# EAGLE design modul_procesora (EAGLE 9.7.0)
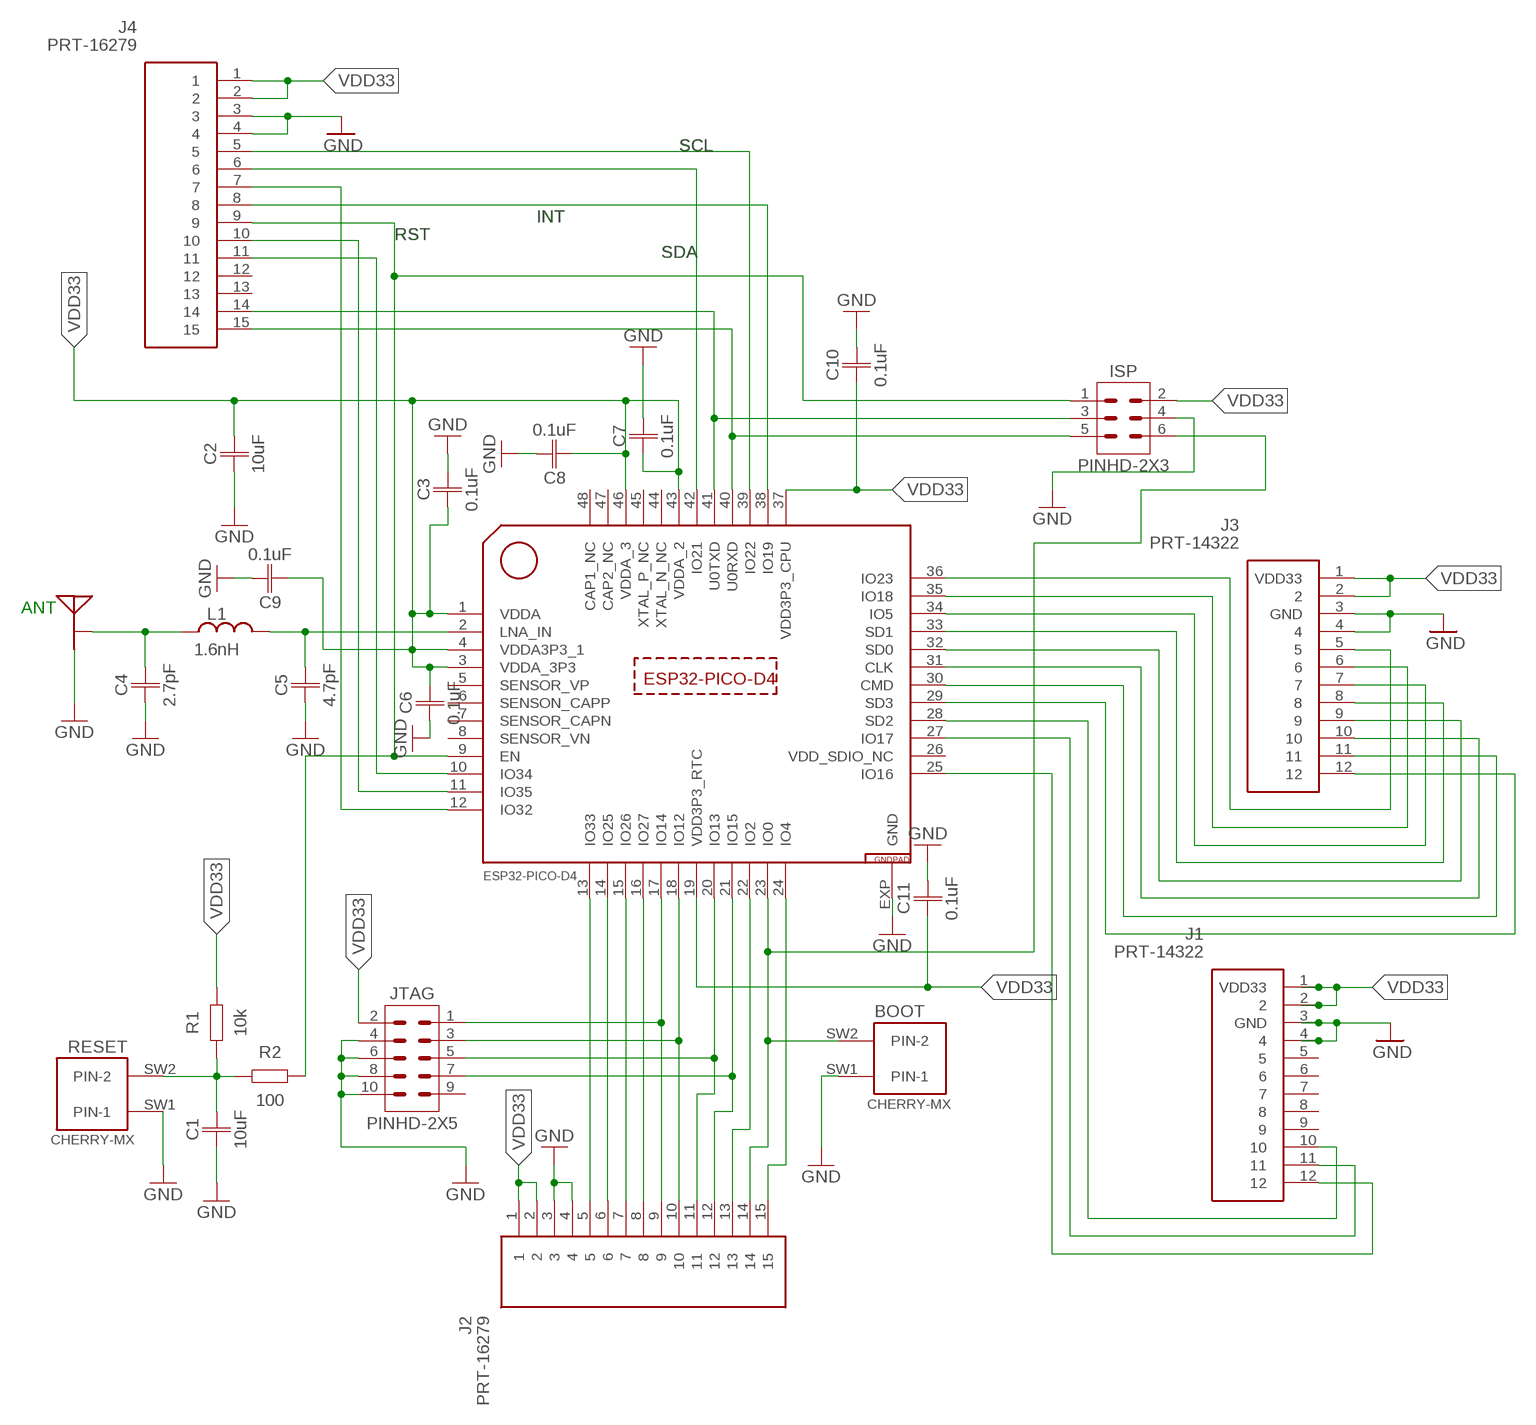
[diagram p0: schematic, sheet 1]

## Parts
ANT  ANT  MEANDER-ANT  [MEANDER-ANT]
BOOT  BOOT  CHERRY-MX  [CHERRY-MX]
C1  10uF  C_CHIP-0402(1005-METRIC)  [CAPC1005X60]
C2  10uF  C_CHIP-0402(1005-METRIC)  [CAPC1005X60]
C3  0.1uF  C_CHIP-0402(1005-METRIC)  [CAPC1005X60]
C4  2.7pF  C_CHIP-0402(1005-METRIC)  [CAPC1005X60]
C5  4.7pF  C_CHIP-0402(1005-METRIC)  [CAPC1005X60]
C6  0.1uF  C_CHIP-0402(1005-METRIC)  [CAPC1005X60]
C7  0.1uF  C_CHIP-0402(1005-METRIC)  [CAPC1005X60]
C8  0.1uF  C_CHIP-0402(1005-METRIC)  [CAPC1005X60]
C9  0.1uF  C_CHIP-0402(1005-METRIC)  [CAPC1005X60]
C10  0.1uF  C_CHIP-0402(1005-METRIC)  [CAPC1005X60]
C11  0.1uF  C_CHIP-0402(1005-METRIC)  [CAPC1005X60]
ISP  PINHD-2X3  [2X03]
J1  PRT-14322  [RHDR12W87P0X254_1X12_3103X250X]
J2  PRT-16279  [PRT16279]
J3  PRT-14322  [RHDR12W87P0X254_1X12_3103X250X]
J4  PRT-16279  [PRT16279]
JTAG  PINHD-2X5  [2X05]
L1  1.6nH  INDUCTOR_CHIP-0402(1006-METRIC)  [INDC1006X60N]
R1  10k  R_CHIP-0402(1005-METRIC)  [RESC1005X40]
R2  100  R_CHIP-0402(1005-METRIC)  [RESC1005X40]
RESET  CHERRY-MX  [CHERRY-MX]
U$1  ESP32-PICO-D4  [QFN48]

## Nets
GND: ANT.FEED BOOT.SW1(PIN-1) C1.1 C2.1 C3.2 C4.1 C5.1 C6.1 C7.2 C8.2 C9.2 C10.2 C11.2 ISP.4 J1.3(GND) J1.4 J2.3 J2.4 J3.3(GND) J3.4 J4.3 J4.4 JTAG.4 JTAG.6 JTAG.8 JTAG.10 RESET.SW1(PIN-1) U$1.EXP(GND)
INT: J4.8 U$1.38(IO19)
N$1: BOOT.SW2(PIN-2) ISP.6 J2.14 U$1.23(IO0)
N$2: C1.2 R1.1 R2.1 RESET.SW2(PIN-2)
N$4: J2.9 JTAG.1 U$1.17(IO14)
N$5: J2.10 JTAG.3 U$1.18(IO12)
N$6: J2.11 JTAG.5 U$1.20(IO13)
N$7: J2.12 JTAG.7 U$1.21(IO15)
N$8: ISP.5 J4.15 U$1.40(U0RXD)
N$9: ISP.3 J4.14 U$1.41(U0TXD)
N$10: ANT.GND C4.2 L1.1
N$11: C5.2 L1.2 U$1.2(LNA_IN)
N$12: J3.5 U$1.36(IO23)
N$13: J3.6 U$1.35(IO18)
N$14: J3.7 U$1.34(IO5)
N$15: J3.8 U$1.33(SD1)
N$16: J3.9 U$1.32(SD0)
N$17: J3.10 U$1.31(CLK)
N$18: J3.11 U$1.30(CMD)
N$19: J3.12 U$1.29(SD3)
N$20: J1.10 U$1.28(SD2)
N$21: J1.11 U$1.27(IO17)
N$22: J1.12 U$1.25(IO16)
N$23: J2.15 U$1.24(IO4)
N$24: J2.13 U$1.22(IO2)
N$25: J2.8 U$1.16(IO27)
N$26: J2.7 U$1.15(IO26)
N$27: J2.6 U$1.14(IO25)
N$28: J2.5 U$1.13(IO33)
N$32: J4.7 U$1.12(IO32)
N$33: J4.10 U$1.11(IO35)
N$34: J4.11 U$1.10(IO34)
RST: ISP.1 J4.9 R2.2 U$1.9(EN)
SCL: J4.5 U$1.39(IO22)
SDA: J4.6 U$1.42(IO21)
VDD33: C2.2 C3.1 C6.2 C7.1 C8.1 C9.1 C10.1 C11.1 ISP.2 J1.1(VDD33) J1.2 J2.1 J2.2 J3.1(VDD33) J3.2 J4.1 J4.2 JTAG.2 R1.2 U$1.1(VDDA) U$1.3(VDDA_3P3) U$1.4(VDDA3P3_1) U$1.19(VDD3P3_RTC) U$1.37(VDD3P3_CPU) U$1.43(VDDA_2) U$1.46(VDDA_3)
Unconnected: J1.5 J1.6 J1.7 J1.8 J1.9 J4.12 J4.13 JTAG.9 U$1.5(SENSOR_VP) U$1.6(SENSON_CAPP) U$1.7(SENSOR_CAPN) U$1.8(SENSOR_VN) U$1.44(XTAL_N_NC) U$1.45(XTAL_P_NC) U$1.47(CAP2_NC) U$1.48(CAP1_NC)

## Notes on the sheet
- SCL
- INT
- RST
- SDA
- ANT

## Power pins joined to a net without a drawn wire
VDD_SDIO_NC: U$1.26(VDD_SDIO_NC)

## Library data of the parts
ANT = Antennas:MEANDER-ANT
BOOT RESET = cherrymx:CHERRY-MX: Cherry MX series keyswitch
C1-C11 = Capacitor:C: Capacitor - Generic; CATEGORY: Capacitor; PACKAGE_SIZE: 0402; PACKAGE_TYPE: Surface Mount; SUBCATEGORY: Ceramic Capacitors; TYPE: MLCC
ISP = Connector:PINHD-2X3: Pin Header; CATEGORY: Connectors; DESCRIPTION: Header-Straight-2x3 Position; PACKAGE_TYPE: Through Hole; PITCH: 0.100" (2.54mm); SUBCATEGORY: Headers; TYPE: Male Pins
J1 J3 = PRT-14322:PRT-14322: SparkFun Accessories Photon Stackable Header- 12 Pin Source: Datasheet <https://cdn.sparkfun.com/datasheets/Prototyping/SP-140520-XX-001.pdf>; DESCRIPTION: SparkFun Accessories Photon Stackable Header- 12 Pin; HEIGHT: 8.65mm; MANUFACTURER_NAME: SparkFun; MANUFACTURER_PART_NUMBER: PRT-14322; MOUSER_PART_NUMBER: 474-PRT-14322; MOUSER_PRICE-STOCK: https://www.mouser.co.uk/ProductDetail/SparkFun/PRT-14322?qs=YCa%2FAAYMW006l9RrtPHkxQ%3D%3D
J2 J4 = PRT-16279:PRT-16279: ARDUINO NANO STACKABLE HEADERS Source: Datasheet <https://cdn.sparkfun.com/assets/8/d/8/4/7/DS-16279-Arduino_Nano_Stackable_Header_Kit.pdf>; DESCRIPTION: ARDUINO NANO STACKABLE HEADERS; HEIGHT: 8.65mm; MANUFACTURER_NAME: SparkFun; MANUFACTURER_PART_NUMBER: PRT-16279; MOUSER_PART_NUMBER: 474-PRT-16279; MOUSER_PRICE-STOCK: https://www.mouser.co.uk/ProductDetail/SparkFun/PRT-16279?qs=vmHwEFxEFR8I6W1vfufYPg%3D%3D
JTAG = Connector:PINHD-2X5: Pin Header; CATEGORY: Connectors; DESCRIPTION: Header-Straight-2x5 Position; PACKAGE_TYPE: Through Hole; PITCH: 0.100" (2.54mm); SUBCATEGORY: Headers; TYPE: Male Pins
L1 = Tinkercad:INDUCTOR: Inductor Fixed - Generic; CATEGORY: Inductor; SUB-CATEGORY: Fixed
R1 R2 = Resistor:R: Resistor Fixed - Generic; CATEGORY: Resistors; DESCRIPTION: Chip Resistor 1.05 X 0.54 X 0.40 mm body 0402(1005-METRIC) Package; PACKAGE_SIZE: 0402; PACKAGE_TYPE: Surface Mount
U$1 = ESP32-PICO-D4:ESP32-PICO-D4

## Board
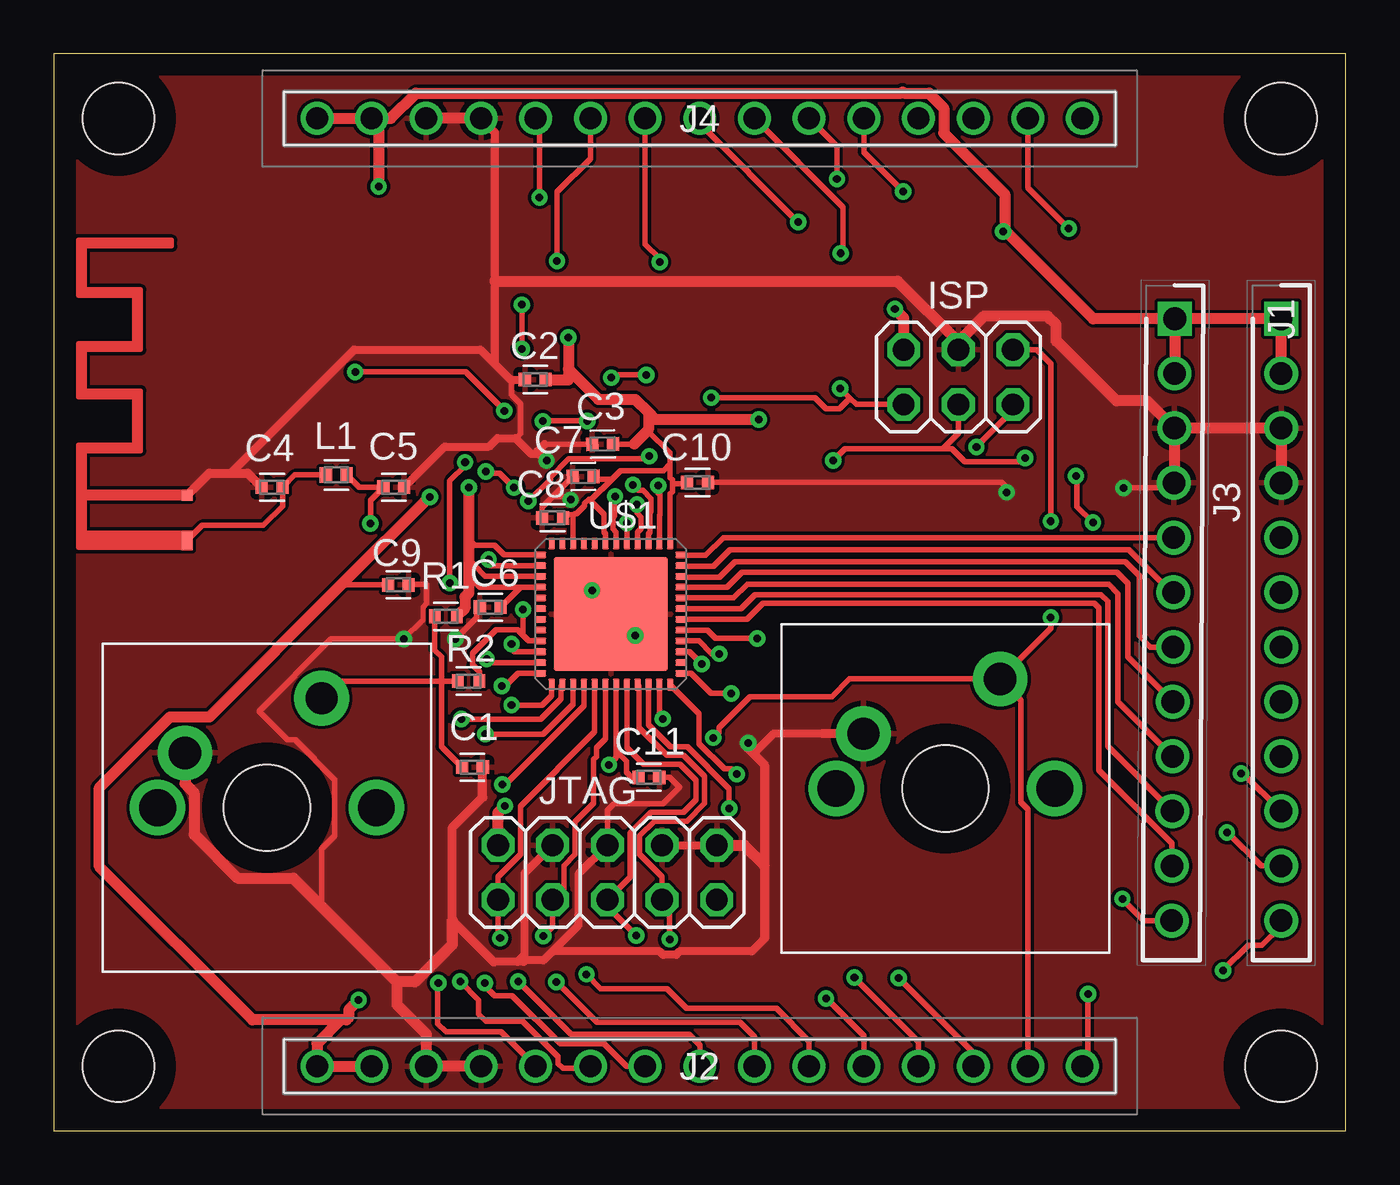
[diagram p1: board, top side]
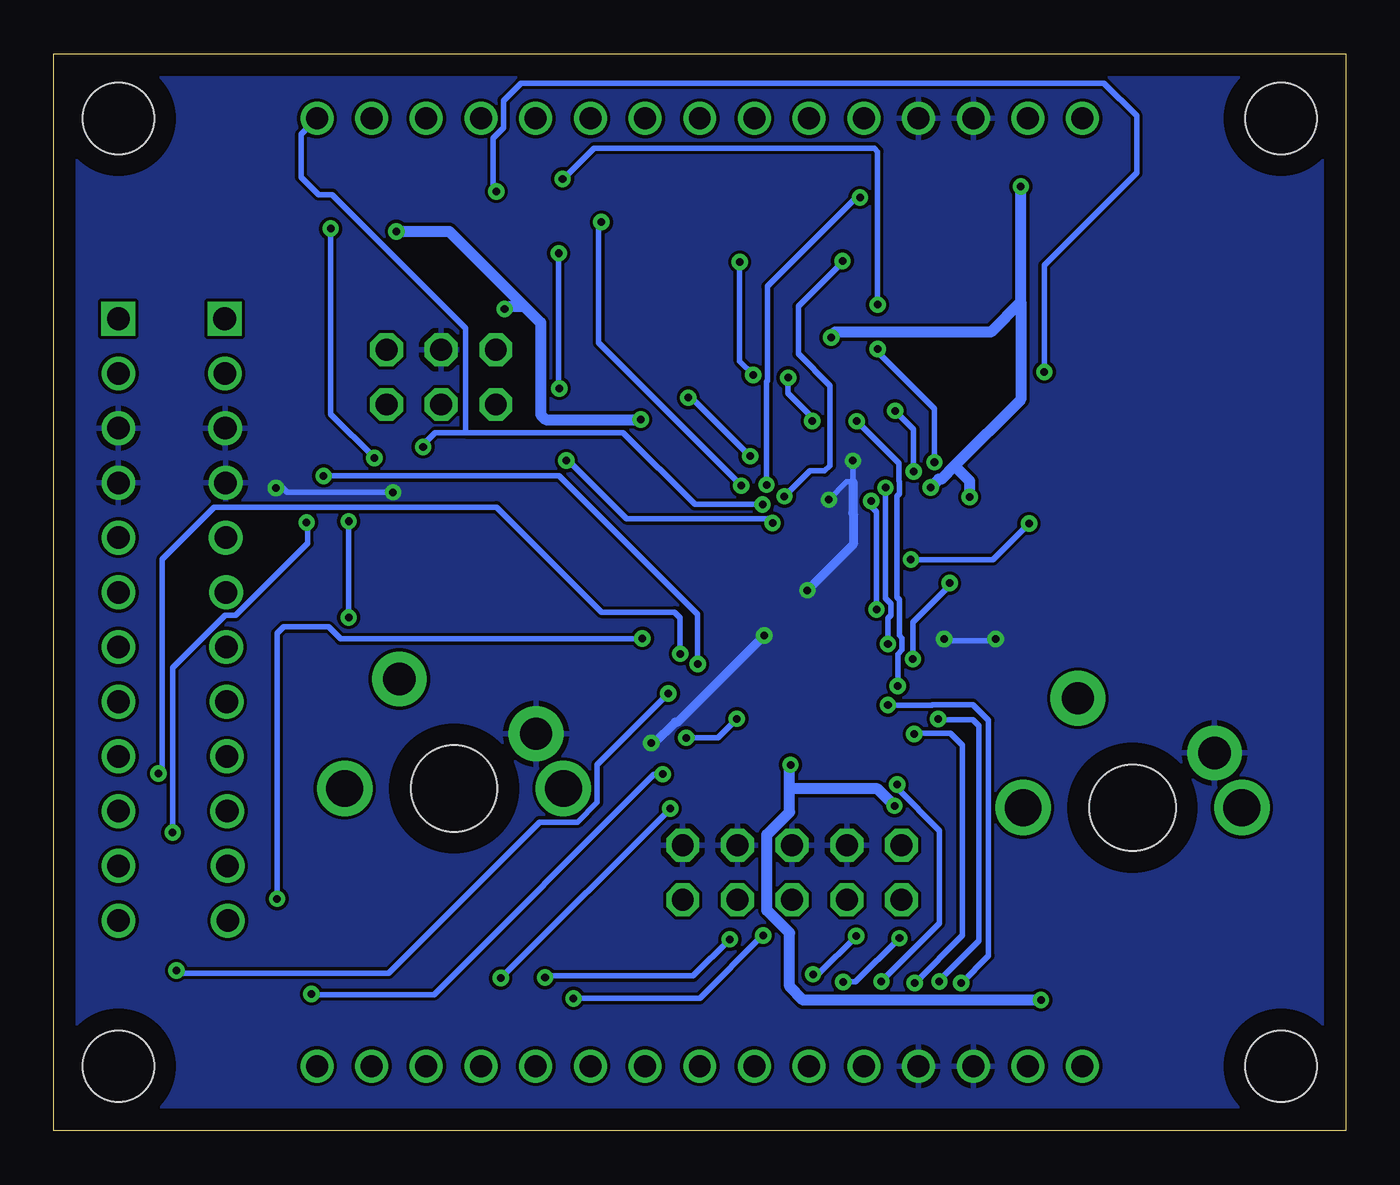
[diagram p2: board, bottom side, seen from below]

Size 60 x 50 mm. Coordinates in mm from the lower left corner, seen from the top.
Outline: 0,0 60,0 60,50 0,50 0,0
Copper layers (1*16): Top 0.035mm / dielectric 1.5mm / Bottom 0.035mm
Design rules "Fusion Electronics Design Rules": minimum track width 6mil, minimum drill 0.35mm, track to track 6mil, track to pad 6mil, pad to pad 6mil, via to via 6mil, smd to smd 6mil, copper to edge 40mil, drill to drill 6mil, minimum pad ring 10mil, minimum via ring 8mil, stop-mask expansion 4mil, vias tented up to drill 9999mil, thermal gap 10mil

### Footprints (pad centres in the part's own frame; a part is rotated, then mirrored left to right if it is on the bottom)
MEANDER-ANT = smd 0.5 x 0.5: FEED 2.55,-0.25 | smd 0.9 x 0.5: GND 0.45,-0.25
CHERRY-MX = drill 1.714 pad 1.93: P$3 -5.08,0; P$4 5.08,0 | drill 1.5 pad 2.54: SW1 -3.81,2.54; SW2 2.54,5.08 | hole 4: 0,0
CAPC1005X60 = smd 0.56 x 0.629: 1 -0.485,0; 2 0.485,0
2X03 = drill 1.016 octagon: 1 -2.54,-1.27; 2 -2.54,1.27; 3 0,-1.27; 4 0,1.27; 5 2.54,-1.27; 6 2.54,1.27
RHDR12W87P0X254_1X12_3103X250X = drill 1.05 pad 1.575 square: 1 -12.7,0 | drill 1.05 pad 1.575: 2 -10.16,0; 3 -7.62,0; 4 -5.08,0; 5 -2.54,0; 6 0,0; 7 2.54,0; 8 5.08,0; 9 7.62,0; 10 10.16,0; 11 12.7,0; 12 15.24,0
PRT16279 = drill 1.02 pad 1.53: 1 -17.78,0; 2 -15.24,0; 3 -12.7,0; 4 -10.16,0; 5 -7.62,0; 6 -5.08,0; 7 -2.54,0; 8 0,0; 9 2.54,0; 10 5.08,0; 11 7.62,0; 12 10.16,0; 13 12.7,0; 14 15.24,0; 15 17.78,0
2X05 = drill 1.016 octagon: 1 -5.08,-1.27; 2 -5.08,1.27; 3 -2.54,-1.27; 4 -2.54,1.27; 5 0,-1.27; 6 0,1.27; 7 2.54,-1.27; 8 2.54,1.27; 9 5.08,-1.27; 10 5.08,1.27
INDC1006X60N = smd 0.56 x 0.729: 1 -0.485,0; 2 0.485,0
RESC1005X40 = smd 0.535 x 0.644: 1 -0.507,0; 2 0.507,0
STAND-OFF = hole 3.302: 0,0
QFN48 = smd 0.55 x 0.3: 1 -3.275,2.75; 2 -3.275,2.25; 3 -3.275,1.75; 4 -3.275,1.25; 5 -3.275,0.75; 6 -3.275,0.25; 7 -3.275,-0.25; 8 -3.275,-0.75; 9 -3.275,-1.25; 10 -3.275,-1.75; 11 -3.275,-2.25; 12 -3.275,-2.75; 25 3.275,-2.75; 26 3.275,-2.25; 27 3.275,-1.75; 28 3.275,-1.25; 29 3.275,-0.75; 30 3.275,-0.25; 31 3.275,0.25; 32 3.275,0.75; 33 3.275,1.25; 34 3.275,1.75; 35 3.275,2.25; 36 3.275,2.75 | smd 0.3 x 0.55: 13 -2.75,-3.275; 14 -2.25,-3.275; 15 -1.75,-3.275; 16 -1.25,-3.275; 17 -0.75,-3.275; 18 -0.25,-3.275; 19 0.25,-3.275; 20 0.75,-3.275; 21 1.25,-3.275; 22 1.75,-3.275; 23 2.25,-3.275; 24 2.75,-3.275; 37 2.75,3.275; 38 2.25,3.275; 39 1.75,3.275; 40 1.25,3.275; 41 0.75,3.275; 42 0.25,3.275; 43 -0.25,3.275; 44 -0.75,3.275; 45 -1.25,3.275; 46 -1.75,3.275; 47 -2.25,3.275; 48 -2.75,3.275 | smd 5.309 x 5.309: EXP 0,0

### Placement (x,y rotation side)
ANT  5.94,26.96 90 top
BOOT  41.41,15.89 0 top
C1  19.44,16.88 180 top
C2  22.36,34.88 0 top
C3  25.49,31.88 181.3 top
C4  10.14,29.88 0 top
C5  15.79,29.88 180 top
C6  20.27,24.31 0 top
C7  24.59,30.38 180.8 top
C8  23.16,28.46 180 top
C9  16,25.35 0 top
C10  29.9,30.1 0 top
C11  27.64,16.41 0 top
ISP  42.01,34.99 0 top
J1  57,25 270 top
J2  30,3 0 top
J3  52,25 269.7 top
J4  30,47 0 top
JTAG  25.71,11.99 0 top
L1  13.12,30.45 0 top
R1  18.2,23.88 0 top
R2  19.26,20.88 0 top
RESET  9.9,15 0 top
STANDOFF1  STAND-OFF  [STAND-OFF]  57,47 0 top
STANDOFF2  STAND-OFF  [STAND-OFF]  3,3 0 top
STANDOFF3  STAND-OFF  [STAND-OFF]  3,47 0 top
STANDOFF4  STAND-OFF  [STAND-OFF]  57,3 0 top
U$1  25.87,23.99 0 top

### Tracks (layer width: path | path; a pad name or v marks a point on that pad's centre or on a via)
GND  (via drill 0.35)
  Top 0.254: 37.58,18.45 BOOT.SW1 | v27,23 26.86,23 | 25,24.86 v25,25.09 | C8.2 22.68,28.95 23.17,29.44 | 23.17,29.44 C7.2 | C3.2 22.8,31.87 22.79,31.88 | 23.17,29.44 23.83,29.44 24,29.26 v24,29.3 | C6.1 19.63,24.16 19.63,23.82 18.72,22.91 18.72,22.84 v18.64,22.84 | C9.2 16.51,25.38 17.32,25.38 17.32,24.5 17.15,24.32 17.15,23.72 v16.26,22.84 12.88,22.84 9.53,19.48 10.86,18.14 11.2,18.14 13.04,16.3 13.04,13.7 12.44,13.1 12.44,10.41 | C10.2 44.02,30.1 44.35,29.77 44.35,29.74 v44.25,29.64 | v49.68,29.84 51.79,29.84 52.04,30.09 | JTAG.6 25.71,14.89 26.01,15.19 28.3,15.19 29.06,15.95 28.6,16.41 C11.2 | 21.2,34.88 21.26,34.82 21.26,34.16 21.67,33.76 21.67,32.37 21.45,32.15
  Top 0.381: JTAG.8 JTAG.10 | JTAG.6 24.36,11.91 24.36,9.53 23.16,8.33 | 21.54,7.84 20.43,7.84 | JTAG.4 21.84,11.93 21.84,8.14 21.54,7.84 | 35.68,18.45 33.44,18.45 32.49,17.51 | 33,8.91 32.42,8.33 29.06,8.33 28.9,8.17 28.3,8.17 28.14,8.33 23.16,8.33 | 21.54,7.84 21.83,7.84 21.9,7.91 22.74,7.91 23.16,8.33 | J4.4 20.47,46.37 20.47,39.45 20.47,35.61 | 20.47,35.61 21.2,34.88 C2.1 | 22.45,31.55 22.79,31.88 | 8.2,30.54 13.94,36.27 19.81,36.27 20.47,35.61 | C5.1 18.15,31.76 20.21,31.76 20.61,32.15 21.45,32.15 22.17,31.43 22.57,31.43
  Top 0.406: C4.1 9,30.54 8.2,30.54 7.22,30.54 ANT.FEED | 20.43,7.84 18.5,9.77 18.5,14.06 19.93,15.48 C1.1 | 35.68,18.45 37.58,18.45 | 26.86,23 U$1.EXP 25,24.86 | 33,8.91 33,12.32 33,17 32.49,17.51 32.25,17.75 v32.25,18 | 22.45,31.55 22.57,31.43 v22.89,31.11
  Top 0.508: RESET.SW1 6.09,16.12 6.51,15.7 6.51,13.76 8.54,11.73 11.12,11.73 12.44,10.41 15.93,6.92 | 15.93,6.92 15.93,5.87 17.3,4.5 J2.3 J2.4 | J3.3 52.04,30.09 J3.4 | J1.4 J1.3 J3.3 | J3.3 | J4.4 J4.3 | 18.5,9.77 18.5,8.64 16.77,6.92 15.93,6.92 | JTAG.10 32.06,13.26 33,12.32 | J3.3 50.78,33.88 49.35,33.88 46.56,36.68 46.56,37.41 46.15,37.82 43.2,37.82 42.01,36.62 | 42.01,36.62 ISP.4 | 20.47,39.45 39.19,39.45 42.01,36.62
  Bottom 0.254: v24,29.3 23.18,30.12 22.89,30.12 v22.89,31.11 | v18.64,22.84 18.57,22.76 16.26,22.76 v16.26,22.84 | v44.25,29.64 49.17,29.64 49.38,29.84 v49.68,29.84
  Bottom 0.406: v25,25.09 22.86,27.23 22.86,28.65 22.89,28.68 22.89,30.12 | v27,23 31.02,18.98 31.14,18.98 32.12,18 v32.25,18
  pour Top: 0.08,0.08 59.92,0.08 59.92,49.92 0.08,49.92
  pour Bottom: 0.08,0.08 59.92,0.08 59.92,49.92 0.08,49.92
INT  (via drill 0.35)
  Top 0.254: v34.57,42.19 30,46.76 J4.8 | U$1.38 28.12,28.57 28.15,28.6 28.15,29.52 28.07,29.6 v28.07,29.95
  Bottom 0.254: v34.57,42.19 34.7,42.19 34.7,36.58 v28.07,29.95
N$1  (via drill 0.35)
  Top 0.254: BOOT.SW2 36.96,20.98 36.14,20.16 32.33,20.16 30.88,18.72 30.88,18.5 v30.63,18.24 | U$1.23 28.12,19.18 28.17,19.13 v28.28,19.13 | J2.14 45.24,14.93 44.92,15.24 44.92,20 BOOT.SW2 | BOOT.SW2 46.3,23.32 v46.3,23.83 | ISP.6 45.66,36.26 46.3,35.61 v46.3,28.3
  Bottom 0.254: v46.3,23.83 v46.3,28.3 | v28.28,19.13 29.16,18.24 v30.63,18.24
N$2
  Top 0.254: RESET.SW2 13.24,20.88 18,20.88 | 18,20.88 R2.1 | R1.1 17.69,22.31 18,22 18,20.88 | C1.2 18,17.84 18,20.88
N$4  (via drill 0.35)
  Top 0.254: U$1.17 25.12,18.52 21.67,15.07 21.67,12.83 20.63,11.79 JTAG.1 20.63,9.06 20.73,8.97 v20.73,8.94 | v23.34,6.91 25.22,5.03 31.88,5.03 32.54,4.37 J2.9
  Bottom 0.254: v20.73,8.94 22.76,6.91 v23.34,6.91
N$5  (via drill 0.35)
  Top 0.254: U$1.18 25.62,18.2 25.2,17.78 25.2,17.38 25.07,17.25 25.07,15.21 24.21,14.36 24.21,12.83 23.7,12.31 23.7,11.25 JTAG.3 23.17,9.45 22.76,9.04 v22.73,9.04 | J2.10 35.08,4.16 33.55,5.69 29.39,5.69 28.47,6.6 25.4,6.6 v24.74,7.26
  Bottom 0.254: v22.73,9.04 24.51,7.26 v24.74,7.26
N$6  (via drill 0.35)
  Top 0.254: J2.11 37.62,4.42 35.89,6.15 v35.87,6.15 | v27.05,9.07 25.71,10.41 JTAG.5 26.75,11.76 26.75,13.81 27.73,14.78 29.23,14.78 29.82,15.37 29.82,16.28 29.08,17.02 27.38,17.02 26.62,17.78 U$1.20
  Bottom 0.254: v35.87,6.15 30,6.15 27.08,9.07 v27.05,9.07
N$7  (via drill 0.35)
  Top 0.254: U$1.21 27.19,20.64 27.19,18.71 28.48,17.42 29.25,17.42 30.23,16.45 30.23,15.2 29.4,14.38 27.89,14.38 27.21,13.69 27.21,12.83 28.25,11.79 JTAG.7 28.6,10.37 v28.6,8.89 | v37.19,7.11 40.16,4.14 J2.12
  Bottom 0.254: v28.6,8.89 30.3,7.19 37.19,7.19 v37.19,7.11
N$8  (via drill 0.35)
  Top 0.254: v42.85,31.75 44.55,33.45 ISP.5 | U$1.40 27.12,27.79 27.28,27.95 27.28,28.49 27.08,28.68 v27.08,29.08
  Bottom 0.254: 40.87,32.41 33.55,32.41 30.22,29.08 v27.08,29.08 | 40.87,32.41 42.29,32.41 42.88,31.83 42.88,31.77 v42.85,31.75 | 40.87,32.41 40.87,37.26 47.07,43.46 47.7,43.46 48.51,44.27 48.51,46.27 J4.15
N$9  (via drill 0.35)
  Top 0.254: U$1.41 26.62,27.99 26.59,28.02 26.59,28.19 v26.62,28.22 | v36.2,31.11 36.75,31.67 41.3,31.67 | 41.3,31.67 42.01,32.38 ISP.3 | 41.3,31.67 41.71,31.67 42.32,31.06 44.88,31.06 45.06,31.24 v45.11,31.24 | v47.14,41.88 45.24,43.79 J4.14
  Bottom 0.254: v26.62,28.22 26.82,28.42 33.4,28.42 36.09,31.11 v36.2,31.11 | v45.11,31.24 47.14,33.27 v47.14,41.88
N$10
  Top 0.254: L1.1 11.2,30.45 C4.2 10.62,29 9.73,28.11 6.89,28.11 ANT.GND
N$11  (via drill 0.35)
  Top 0.254: L1.2 14.18,29.88 C5.2 14.71,29.28 v14.71,28.19 | U$1.2 20.27,26.24 20.19,26.31 v20.19,26.52
  Bottom 0.254: v20.19,26.52 16.38,26.52 v14.71,28.19
N$12
  Top 0.254: J3.5 47.15,27.54 31.1,27.54 30.28,26.72 29.16,26.72 U$1.36
N$13
  Top 0.254: U$1.35 29.17,26.21 30.63,26.21 31.39,26.98 49.94,26.98 51.91,25 J3.6
N$14
  Top 0.254: J3.7 50.93,22.46 50.93,22.45 50.41,22.97 50.41,25.67 50.47,25.73 49.77,26.43 31.64,26.43 30.91,25.7 29.18,25.7 U$1.34
N$15
  Top 0.254: U$1.33 31.26,25.24 31.95,25.93 49.38,25.93 49.89,25.43 49.89,22.01 J3.8
N$16
  Top 0.254: U$1.32 31.57,24.74 32.21,25.38 49,25.38 49.43,24.94 49.43,19.91 J3.9
N$17
  Top 0.254: U$1.31 31.91,24.24 32.56,24.89 48.64,24.89 48.95,24.59 48.95,17.84 J3.10
N$18
  Top 0.254: J3.11 51.93,13.34 48.54,16.73 48.54,24.28 48.34,24.49 32.94,24.49 32.2,23.74 U$1.30
N$19  (via drill 0.35)
  Top 0.254: J3.12 50.62,9.76 49.63,10.74 v49.63,10.77 | v32.66,22.86 30.73,22.86 30.35,23.24 U$1.29
  Bottom 0.254: v49.63,10.77 49.63,23.09 49.33,23.39 47.24,23.39 46.69,22.84 32.69,22.84 v32.66,22.86
N$20  (via drill 0.35)
  Top 0.254: J1.10 55.25,16.59 v55.14,16.59 | v30.91,22.14 30.55,22.14 29.95,22.74 U$1.28
  Bottom 0.254: v55.14,16.59 54.97,16.76 54.97,26.54 52.55,28.96 39.45,28.96 34.57,24.08 31.17,24.08 30.91,23.82 v30.91,22.14
N$21  (via drill 0.35)
  Top 0.254: J1.11 56.08,12.3 54.51,13.87 v54.48,13.84 | v48.26,28.25 47.52,28.98 47.52,30.4 v47.47,30.4 | v30.1,21.67 29.52,22.24 U$1.27
  Bottom 0.254: v54.48,13.84 54.48,21.49 52.04,23.93 51.55,23.93 48.21,27.28 48.21,28.25 v48.26,28.25 | v47.47,30.4 36.52,30.4 30.1,23.98 v30.1,21.67
N$22  (via drill 0.35)
  Top 0.254: v54.3,7.44 55.47,8.61 56.11,8.61 57,9.5 J1.12 | U$1.25 29.59,21.24 30.53,20.31 v31.46,20.31
  Bottom 0.254: v31.46,20.31 34.77,17 34.77,15.24 35.68,14.32 37.44,14.32 44.45,7.32 54.3,7.32 v54.3,7.44
N$23  (via drill 0.35)
  Top 0.254: v48.03,6.35 48.03,3.25 J2.15 | v31.73,16.55 31.47,16.8 31.14,16.8 29.98,17.97 29.98,19.36 U$1.24
  Bottom 0.254: v48.03,6.35 48.03,6.33 42.34,6.33 32.11,16.55 v31.73,16.55
N$24  (via drill 0.35)
  Top 0.254: v39.24,7.09 42.7,3.63 J2.13 | U$1.22 27.62,18.85 28.64,17.83 29.42,17.83 31.37,15.88 v31.37,14.96
  Bottom 0.254: v31.37,14.96 39.12,7.21 39.19,7.21 39.24,7.16 v39.24,7.09
N$25  (via drill 0.35)
  Top 0.254: J2.8 30,3.96 29.49,4.47 24.03,4.47 v21.57,6.93 | U$1.16 24.62,19.73 20.96,16.07 v20.83,16.07
  Bottom 0.254: v21.57,6.93 18.87,9.63 18.87,13.94 20.83,15.89 v20.83,16.07
N$26  (via drill 0.35)
  Top 0.254: J2.7 26.59,3 25.55,4.04 24.49,4.04 24.48,4.04 23.53,4.04 21.29,6.28 20.47,6.28 20.02,6.73 v20.02,6.86 | v20.04,18.41 22.73,18.41 24.12,19.8 U$1.15
  Bottom 0.254: v20.02,6.86 17.8,9.07 17.8,17.91 18.36,18.47 19.99,18.47 v20.04,18.41
N$27  (via drill 0.35)
  Top 0.254: U$1.14 23.55,20.64 23.55,20.05 22.6,19.1 18.95,19.1 v18.92,19.12 | v18.87,6.93 19.74,6.07 19.74,5.41 20.07,5.08 21.78,5.08 23.42,3.43 23.42,3.12 23.65,2.9 24.82,2.9 J2.6
  Bottom 0.254: v18.87,6.93 18.87,6.99 17.04,8.81 17.04,18.8 17.32,19.07 18.88,19.07 v18.92,19.12
N$28  (via drill 0.35)
  Top 0.254: J2.5 20.78,4.6 18.21,4.6 17.83,4.98 17.83,6.83 v17.86,6.86 | v21.26,19.76 22.68,19.76 23.12,20.2 U$1.13
  Bottom 0.254: v17.86,6.86 16.59,8.13 16.59,19.05 17.32,19.78 19.2,19.78 19.21,19.76 v21.26,19.76
N$32  (via drill 0.35)
  Top 0.254: J4.7 27.46,41.17 28.14,40.49 v28.14,40.34 | v27.52,35.09 25.84,35.09 25.81,35.05 v25.89,34.96 | v24.78,32.96 22.72,32.96 v22.71,32.94 | v20.8,20.65 20.98,20.65 21.57,21.24 U$1.12
  Bottom 0.254: v28.14,40.34 28.14,35.74 27.51,35.1 v27.52,35.09 | v25.89,34.96 25.89,34.25 24.69,33.05 v24.78,32.96 | v20.8,20.65 20.8,22.13 20.6,22.33 20.6,22.88 20.73,23 20.73,24.65 20.85,24.77 20.85,29.45 20.72,29.59 20.72,30.13 20.75,30.17 20.75,30.99 v22.71,32.94
N$33  (via drill 0.35)
  Top 0.254: v18.39,25.43 18.39,30.18 19.1,30.89 v19.1,31.04 | v21.74,36.3 v21.74,38.35 | v36.37,44.2 36.37,45.71 J4.10 | v20.1,21.91 20.13,21.91 20.3,21.73 22.59,21.73 U$1.11
  Bottom 0.254: v18.39,25.43 18.34,25.38 20.1,23.61 v20.1,21.91 | v19.1,31.04 19.1,33.53 21.74,36.17 v21.74,36.3 | v21.74,38.35 21.74,45.47 21.89,45.62 34.9,45.62 36.32,44.2 v36.37,44.2
N$34  (via drill 0.35)
  Top 0.254: U$1.10 21.4,22.24 21.26,22.38 v21.26,22.61 | v20.07,30.61 20.14,30.53 20.7,30.53 v21.37,29.86 | v20.93,33.43 19.13,35.23 14.07,35.23 14.05,35.2 14.02,35.2 v13.99,35.23 | v39.45,43.61 37.62,45.44 J4.11
  Bottom 0.254: v20.07,30.61 20.07,32.56 v20.93,33.43 | v13.99,35.23 13.99,40.18 9.7,44.48 9.7,47.12 11.23,48.64 38.3,48.64 39.12,47.83 39.12,46.57 39.6,46.08 39.6,43.71 39.5,43.61 v39.45,43.61 | v21.26,22.61 21.26,23.81 21.13,23.93 21.13,24.48 21.38,24.73 21.38,29.85 v21.37,29.86
RST  (via drill 0.35)
  Top 0.254: J4.9 36.65,42.89 36.65,40.74 v36.55,40.74 | 36.98,34.01 37.27,33.72 ISP.1 | 36.98,34.01 v36.52,34.47 | R2.2 19.77,21.3 19.44,21.63 19.44,22.18 20.53,23.26 21.53,23.26 21.8,23 | U$1.9 22.06,22.74 21.8,23 | 21.8,23 21.8,24.19 21.82,24.21 v21.79,24.21 | v27.66,31.32 27.66,31.29 27.56,31.19 23.9,31.19 23.06,30.35 23.06,30.26 v22.04,29.24 | v30.53,34.04 35.36,34.04 35.87,33.53 36.5,33.53 36.98,34.01
  Bottom 0.254: v36.55,40.74 36.55,34.54 36.5,34.49 v36.52,34.47 | v21.79,24.21 21.79,28.75 22.04,29 v22.04,29.24 | v27.66,31.32 30.43,34.09 30.53,34.09 v30.53,34.04
SCL  (via drill 0.35)
  Top 0.254: v22.55,43.33 22.55,46.83 J4.5 | U$1.39 27.62,27.71 27.68,27.78 27.68,28.71 27.74,28.77 27.74,29.35 27.36,29.74 27.15,29.74 v26.9,29.99
  Bottom 0.254: v22.55,43.33 22.73,43.33 26.86,39.2 26.86,34.82 26.9,34.78 v26.9,29.99
SDA  (via drill 0.35)
  Top 0.254: v23.37,40.39 23.37,43.59 24.92,45.14 J4.6 | U$1.42 26.12,27.79 25.96,27.95 25.96,28.49 26.04,28.57 26.04,29.57 26.04,29.49 v26.07,29.46
  Bottom 0.254: v23.37,40.39 23.37,40.34 25.43,38.28 25.43,36.07 23.95,34.59 23.95,30.89 24.21,30.63 24.89,30.63 v26.07,29.46
VDD33  (via drill 0.35)
  Top 0.254: 19.28,25.76 19.79,25.24 21.69,25.24 | 21.69,25.24 U$1.4 | 19.28,26.52 19.54,26.26 19.54,26.25 20.04,25.74 U$1.3 | U$1.1 20.9,26.74 20.46,27.18 19.54,27.18 19.28,27.43 | 28.63,30.96 28.63,31.47 27.58,32.51 | U$1.46 24.12,28.59 | U$1.37 28.62,29.57 28.73,29.68 28.73,30.05 | 24.85,29.32 25.55,28.62 25.55,27.78 25.62,27.71 U$1.43 | 28.63,30.96 28.63,30.33 28.73,30.22 28.73,30.05 | 28.63,30.96 28.31,30.65 26.33,30.65 25.93,30.25 | 24.85,29.32 24.86,29.33 24.98,29.33 25.44,29.78 25.47,29.78 25.93,30.25 | 25.93,30.25 25.21,30.25 C7.1 | 24.12,28.59 23.78,28.59 C8.1 | 26.95,31.88 25.98,31.88 C3.1 | 24.85,29.32 24.66,29.13 24.66,29.03 24.27,28.64 24.17,28.64 24.12,28.59 | C6.2 21.69,25.24 | C9.1 13.49,25.35 13.42,25.41 | C10.1 29.36,30.05 28.73,30.05 | U$1.19 26.12,17.63 | 26.12,17.63 26.12,17.33 26.04,17.25 26.04,17.24 v25.79,16.99 | 26.12,17.63 26.59,17.15 26.59,16.64 26.82,16.41 C11.1
  Top 0.508: v19.28,29.87 19.28,27.43 19.28,26.52 19.28,25.76 19.28,24.97 19.1,24.79 19.1,24.27 R1.2 | v15.09,43.84 15.09,46.67 J4.2 | J4.1 J4.2 | 13.32,5.14 12.22,4.04 J2.1 J2.2 | J3.1 52.07,35.17 J3.2 | J1.2 J1.1 J3.1 | v23.9,36.83 23.9,35.36 | 23.9,35.36 23.9,34.85 22.88,34.85 C2.2 | 23.9,35.36 25.3,33.96 27,33.96 27.61,33.35 | 27.61,33.35 27.61,32.54 27.58,32.51 26.95,31.88 | J3.1 48.28,37.7 44.17,41.81 | 44.17,41.81 44.15,41.81 v44.09,41.76 | v32.74,33.02 27.94,33.02 27.61,33.35 | J4.2 15.64,47 16.82,48.17 39.36,48.17 39.42,48.23 39.48,48.17 40.65,48.17 41.33,47.48 41.33,46.32 44.17,43.48 44.17,41.81 | 13.32,5.14 9.23,5.14 2.11,12.27 2.11,15.93 5.4,19.22 7.23,19.22 13.42,25.41 v17.45,29.44 v17.46,29.43 | 13.32,5.14 13.32,5.15 13.58,5.15 13.7,5.26 13.7,5.61 v14.15,6.07 | v39.06,38.15 39.47,37.75 ISP.2 | JTAG.2 20.63,14.76 v20.95,15.09
  Bottom 0.508: 15.09,38.48 v15.09,43.84 | 25.83,15.88 25.83,14.79 26.88,13.74 26.88,10.24 25.83,9.19 25.83,6.71 25.2,6.07 v14.15,6.07 | v23.9,36.83 23.9,36.88 23.7,37.08 16.49,37.08 15.09,38.48 | v44.09,41.76 41.63,41.76 38.12,38.25 | 38.12,38.25 37.39,37.52 37.39,33.25 37.16,33.02 v32.74,33.02 | v19.28,29.87 18.89,30.25 18.78,30.25 18.16,30.86 | 15.09,38.48 15.09,33.94 18.16,30.86 | v17.46,29.43 17.46,30.16 18.16,30.86 | 38.12,38.25 38.89,38.25 38.99,38.15 v39.06,38.15 | v20.95,15.09 21.74,15.88 25.83,15.88 | 25.83,15.88 25.83,16.95 v25.79,16.99
(copper drawn outside any net)
  shapes: Bottom area x1, Top area x1